# EAGLE schematic barduino (EAGLE 8.3.2)
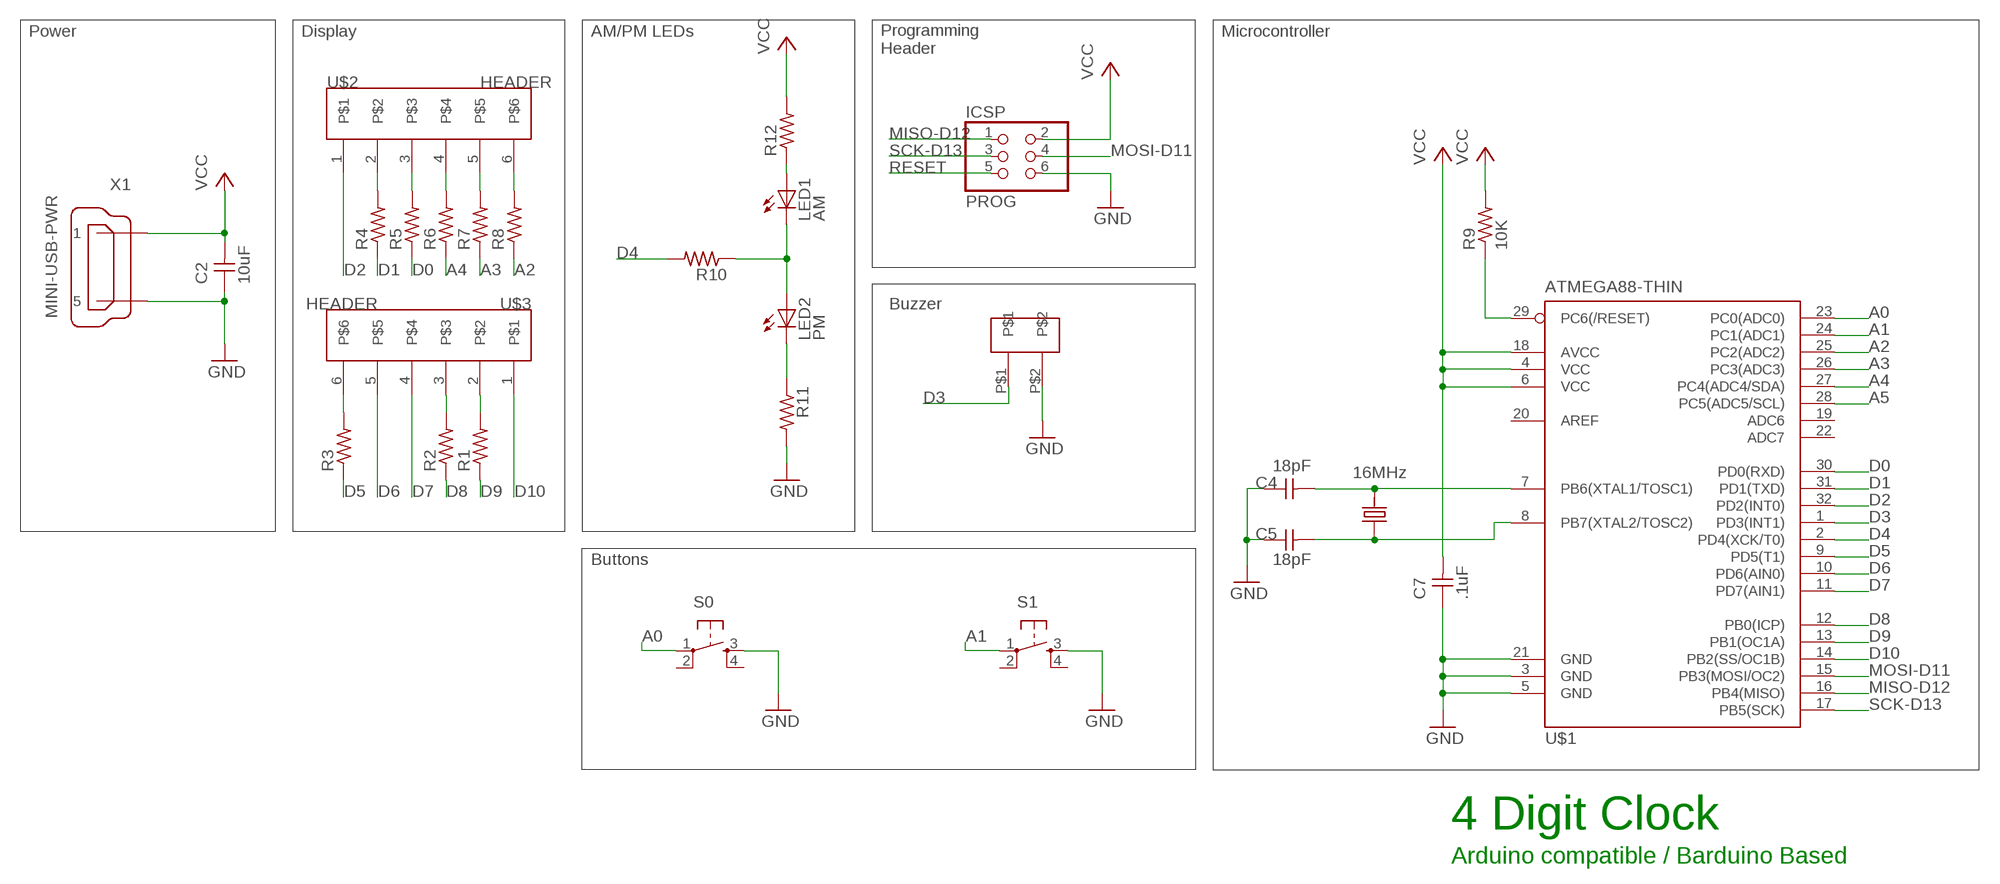
[diagram p0: schematic, sheet 1]

## Parts
C2  10uF  UNPOLARIZED_CAPACITOR1206  [1206]
C4  18pF  UNPOLARIZED_CAPACITOR1206  [1206]
C5  18pF  UNPOLARIZED_CAPACITOR1206  [1206]
C7  .1uF  UNPOLARIZED_CAPACITOR1206  [1206]
ICSP  PROG  PINHD-2X3-SMD  [2X03SMD]
LED1  AM  LEDCHIPLED_1206  [CHIPLED_1206]
LED2  PM  LEDCHIPLED_1206  [CHIPLED_1206]
Q2  16MHz  CRYSTALCS10  [CS10]
R1  R-US_R1206  [R1206]
R2  R-US_R1206  [R1206]
R3  R-US_R1206  [R1206]
R4  R-US_R1206  [R1206]
R5  R-US_R1206  [R1206]
R6  R-US_R1206  [R1206]
R7  R-US_R1206  [R1206]
R8  R-US_R1206  [R1206]
R9  10K  RESISTOR1206  [1206]
R10  R-US_R1206  [R1206]
R11  R-US_R1206  [R1206]
R12  R-US_R1206  [R1206]
S0  6MM_SWITCH6MM_SWITCH  [6MM_SWITCH]
S1  6MM_SWITCH6MM_SWITCH  [6MM_SWITCH]
U$1  ATMEGA88-THIN  [TQFP32-08THIN]
U$2  HEADER  [HEADER]
U$3  HEADER  [HEADER]
U$4  BUZZER  [BUZZER]
X1  MINI-USB-PWR  [UX60-MB-5ST-PWR]

## Nets
A0: S0.1(P) U$1.23(PC0(ADC0))
A1: S1.1(P) U$1.24(PC1(ADC1))
A2: R8.1 U$1.25(PC2(ADC2))
A3: R7.1 U$1.26(PC3(ADC3))
A4: R6.1 U$1.27(PC4(ADC4/SDA))
A5: U$1.28(PC5(ADC5/SCL))
D0: R5.1 U$1.30(PD0(RXD))
D1: R4.1 U$1.31(PD1(TXD))
D2: U$1.32(PD2(INT0)) U$2.1
D3: U$1.1(PD3(INT1)) U$4.P$1
D4: R10.2 U$1.2(PD4(XCK/T0))
D5: R3.1 U$1.9(PD5(T1))
D6: U$1.10(PD6(AIN0)) U$3.5
D7: U$1.11(PD7(AIN1)) U$3.4
D8: R2.1 U$1.12(PB0(ICP))
D9: R1.1 U$1.13(PB1(OC1A))
D10: U$1.14(PB2(SS/OC1B)) U$3.1
GND [power]: C2.1 C4.1 C5.1 C7.1 ICSP.6 R11.2 S0.3(S) S1.3(S) U$1.3(GND) U$1.5(GND) U$1.21(GND) U$4.P$2 X1.5
MISO-D12: ICSP.1 U$1.16(PB4(MISO))
MOSI-D11: ICSP.4 U$1.15(PB3(MOSI/OC2))
N$1 [power]: LED1.A R12.1
N$2: LED2.C R11.1
N$3: LED1.C LED2.A R10.1
N$4: R3.2 U$3.6
N$8: R8.2 U$2.6
N$9: R7.2 U$2.5
N$10: R5.2 U$2.3
N$22: R4.2 U$2.2
N$23: R6.2 U$2.4
N$29: R2.2 U$3.3
N$33: R1.2 U$3.2
PB6: C4.2 Q2.P$2 U$1.7(PB6(XTAL1/TOSC1))
PB7: C5.2 Q2.P$1 U$1.8(PB7(XTAL2/TOSC2))
RESET: ICSP.5 R9.1 U$1.29(PC6(/RESET))
SCK-D13: ICSP.3 U$1.17(PB5(SCK))
VCC [power]: C2.2 C7.2 ICSP.2 R9.2 R12.2 U$1.4(VCC) U$1.6(VCC) U$1.18(AVCC) X1.1
Unconnected: S0.2(P1) S0.4(S1) S1.2(P1) S1.4(S1) U$1.19(ADC6) U$1.20(AREF) U$1.22(ADC7)

## Notes on the sheet
- Power | Display | AM/PM LEDs | Microcontroller
- Programming
  Header
- Buzzer
- Buttons
- 4 Digit Clock
- Arduino compatible / Barduino Based

## Library data of the parts
C2 C4 C5 C7 = ng:UNPOLARIZED_CAPACITOR: unpolarized_capacitor
ICSP = fab:PINHD-2X3-SMD: PIN HEADER
LED1 LED2 = led:LED: LED OSRAM: - CHIPLED LG R971, LG N971, LY N971, LG Q971, LY Q971, LO R971, LY R971 LH N974, LH R974 LS Q976, LO Q976, LY Q976 LO Q996 - Hyper CHIPLED LW Q18S LB Q993, LB Q99A, LB R99A - SideLED LS A670, LO A670, LY A670, LG A670, LP A670 LB A673, LV A673, LT A673, LW A673 LH A674 LY A675 LS A676, LA A676, LO A676, LY A676, LW A676 LS A679, LY A679, LG A679 - Hyper Micro SIDELED® LS Y876, LA Y876, LO Y876, LY Y876 LT Y87S - SmartLED LW L88C, LW L88S LB L89C, LB L89S, LG L890 LS L89K, LO L89K, LY L89K LS L896, LA L896, LO L896, LY L896 - TOPLED LS T670, LO T670, LY T670, LG T670, LP T670 LSG T670, LSP T670, LSY T670, LOP T670, LYG T670 LG T671, LOG T671, LSG T671 LB T673, LV T673, LT T673, LW T673 LH T674 LS T676, LA T676, LO T676, LY T676, LB T676, LH T676, LSB T676, LW T676 LB T67C, LV T67C, LT T67C, LS T67K, LO T67K, LY T67K, LW E67C LS E67B, LA E67B, LO E67B, LY E67B, LB E67C, LV E67C, LT E67C LW T67C LS T679, LY T679, LG T679 LS T770, LO T770, LY T770, LG T770, LP T770 LB T773, LV T773, LT T773, LW T773 LH T774 LS E675, LA E675, LY E675, LS T675 LS T776, LA T776, LO T776, LY T776, LB T776 LHGB T686 LT T68C, LB T68C - Hyper Mini TOPLED® LB M676 - Mini TOPLED Santana® LG M470 LS M47K, LO M47K, LY M47K Source: http://www.osram.convergy.de LUXEON: - LUMILED® LXK2-PW12-R00, LXK2-PW12-S00, LXK2-PW14-U00, LXK2-PW14-V00 LXK2-PM12-R00, LXK2-PM12-S00, LXK2-PM14-U00 LXK2-PE12-Q00, LXK2-PE12-R00, LXK2-PE12-S00, LXK2-PE14-T00, LXK2-PE14-U00 LXK2-PB12-K00, LXK2-PB12-L00, LXK2-PB12-M00, LXK2-PB14-N00, LXK2-PB14-P00, LXK2-PB14-Q00 LXK2-PR12-L00, LXK2-PR12-M00, LXK2-PR14-Q00, LXK2-PR14-R00 LXK2-PD12-Q00, LXK2-PD12-R00, LXK2-PD12-S00 LXK2-PH12-R00, LXK2-PH12-S00 LXK2-PL12-P00, LXK2-PL12-Q00, LXK2-PL12-R00 Source: www.luxeon.com KINGBRIGHT: KA-3528ASYC Source: www.kingbright.com
Q2 = ng:CRYSTAL: CRYSTAL
R1-R8 R10-R12 = resistor:R-US_: RESISTOR, American symbol
R9 = ng:RESISTOR
S0 S1 = ng:6MM_SWITCH: OMRON SWITCH
U$1 = fab:ATMEGA88-THIN
U$2 U$3 = 4-Digit-Clock:HEADER
U$4 = 4-Digit-Clock:BUZZER
X1 = 4-Digit-Clock:MINI-USB-PWR: MINI USB Connector Source: http://www.hirose.co.jp/cataloge_hp/e24000019.pdf

## Net classes
0 default: width 0.635 mm, clearance 0.406 mm
1 power: width 0.635 mm, clearance 0.406 mm